# Altium schematic sheet Battery indicator.SchDoc: Megabit Battery Indicator
size A4; DocumentNumber: 3; Revision: 1; SheetNumber: 3; SheetTotal: 5
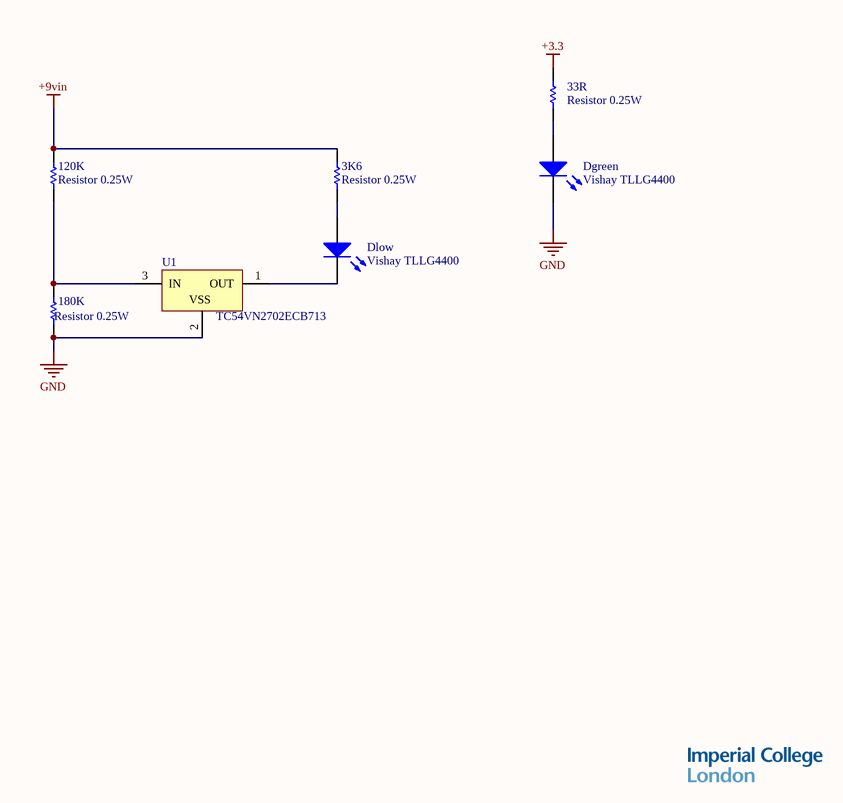
[diagram p0: Battery indicator.SchDoc]

## Parts
3K6  Resistor 0.25W  [PCB-3613466-1]
33R  Resistor 0.25W  [PCB-3613466-1]
120K  Resistor 0.25W  [PCB-3613466-1]
180K  Resistor 0.25W  [PCB-3613466-1]
Dgreen  Vishay TLLG4400  [PCB-a4kbstwpa15hyka10z5q-1]
Dlow  Vishay TLLG4400  [PCB-a4kbstwpa15hyka10z5q-1]
U1  TC54VN2702ECB713  [SOT-23A-CB3_L]

## Nets
+3.3: 33R.2
+9vin: 3K6.2 120K.2
GND: 180K.2 Dgreen.2(K) U1.2(VSS)
Net3K6_1: 3K6.1 Dlow.1(A)
Net33R_1: 33R.1 Dgreen.1(A)
Net120K_1: 120K.1 180K.1 U1.3(IN)
NetDlow_2: Dlow.2(K) U1.1(OUT)

## Notes on the sheet
- Title
- Size:
- Date:
- A4
- Number:
- Time:
- Revision:
- Sheet
- of
- File:

## Library data of the parts
3K6 33R 120K 180K = CMP-b15c796618a36e9b-3: OctopartID: b15c796618a36e9b
Dgreen Dlow = CMP-afe165a651817026-5: LED; PCB ; Green; 0.63mcd; 3mm; T-1; 7mA; 1.9V; 565nm; 25deg; GaP on GaP; 20V; 20mW; -40; Forward Voltage: 2.40 V; Luminous Intensity: 1.20 mcd; Viewing Angle: 25 °; Mounting Style: Through Hole, Radial; Voltage Rating (DC): 2.40 V; Manufacturer Part Number: TLLG4400; Color: Green; OctopartID: afe165a651817026; Number of Pins: 2; Octopart URL: http://octopart.com/tllg4400-vishay-55433990; RoHS: Compliant
U1 = CMP-1440117-2: 1μA Voltage Detector, Open-Drain Output, 2.7V, 3-Pin SOT-23A, Industrial Temperature, Tape and Reel; Lead-Free Status: Lead Free; Power Dissipation: 0.24 W; Quiescent Current: 1.1e-06 A; Supply Current: 1e-06 A; Lifecycle Status: Active; Mounting Style: Surface Mount; Number of Pins: 3; Octopart Url: https://octopart.com/tc54vn2702ecb713-microchip-510969; OctopartID: 3baef2a3d531e469; REACH SVHC Compliance: No SVHC; RoHS: Compliant; Threshold Voltage: 2.7 V